# EAGLE design badge (EAGLE 7.5.0)
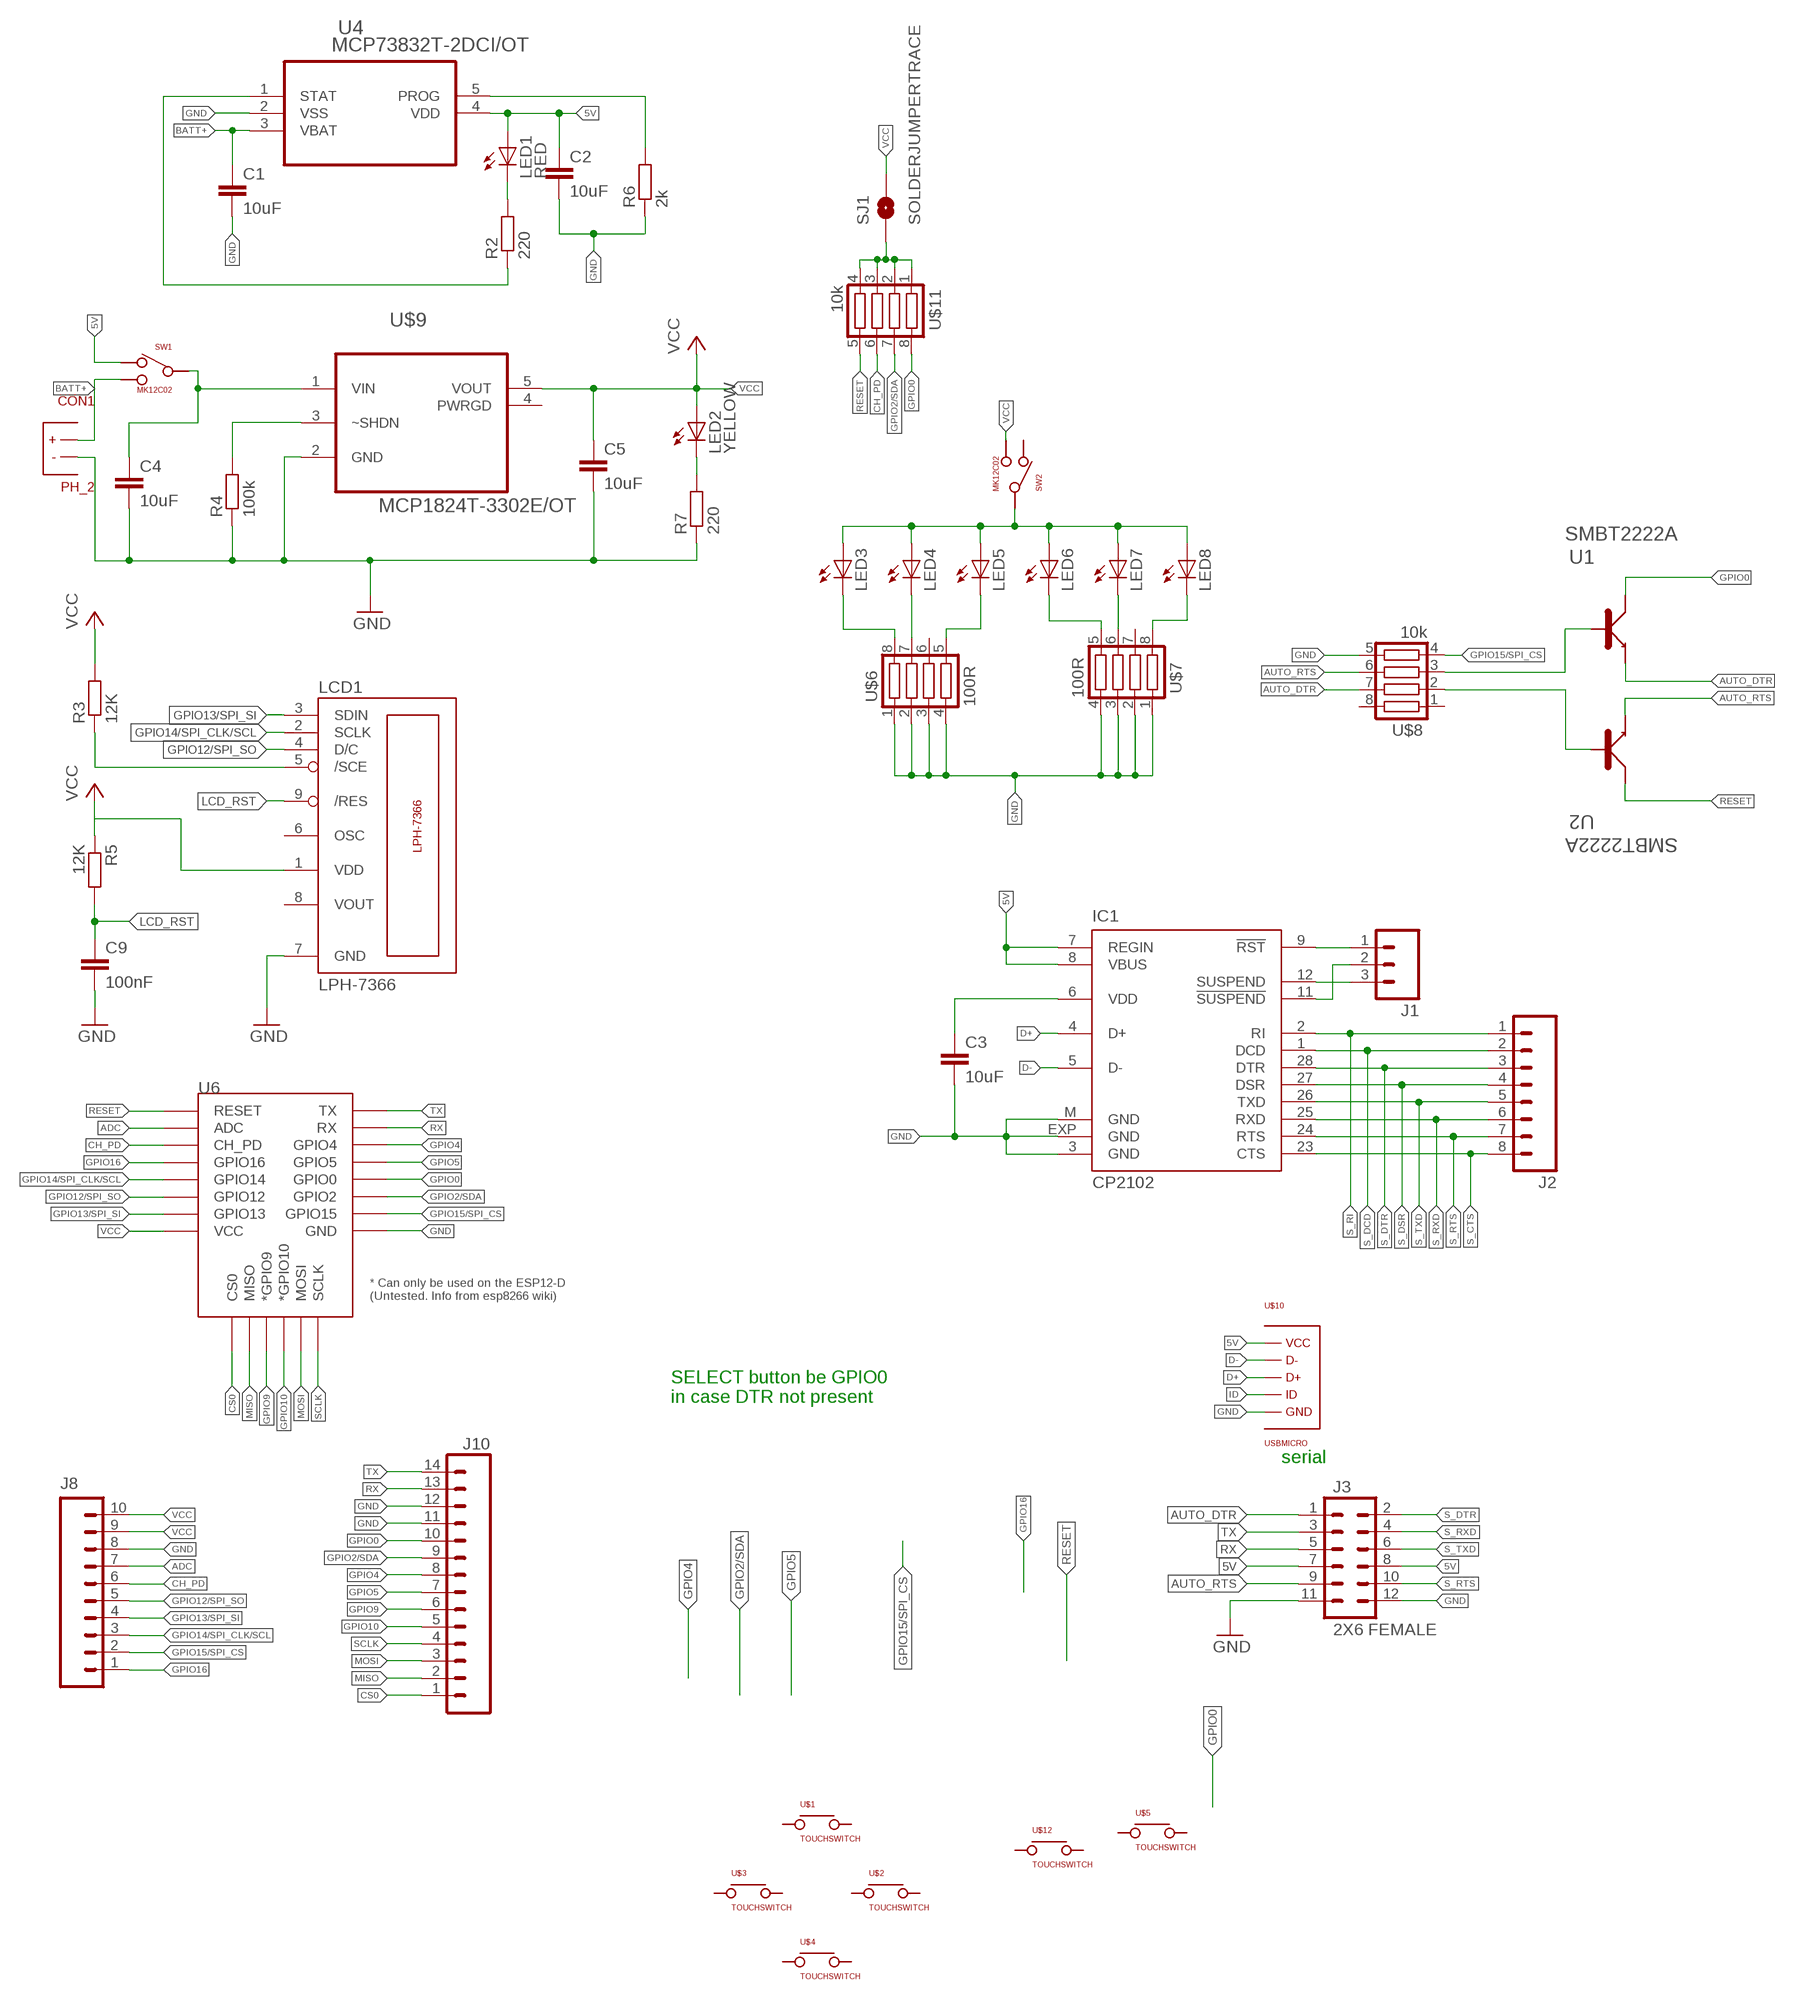
[diagram p0: schematic, sheet 1]

## Parts
C1  10uF  C-EUC0603K  [C0603K]
C2  10uF  C-EUC0603K  [C0603K]
C3  10uF  C-EUC0603K  [C0603K]
C4  10uF  C-EUC0603K  [C0603K]
C5  10uF  C-EUC0603K  [C0603K]
C9  100nF  C-EUC0603K  [C0603K]
CON1  PH_2  [PH_2]
IC1  CP2102  [MLP28]
J1  M03PTH  [1X03]
J2  M08SILK_FEMALE_PTH  [1X08]
J3  2X6 FEMALE  M06X2PTH_FEMALE  [2X6]
J8  M10SILK_FEMALE_PTH  [1X10]
J10  M14  [1X14]
LCD1  LPH-7366  [LPH-7366]
LED1  RED  LEDSML0805  [SML0805]
LED2  YELLOW  LEDSML0805  [SML0805]
LED3  LEDSML0805  [SML0805]
LED4  LEDSML0805  [SML0805]
LED5  LEDSML0805  [SML0805]
LED6  LEDSML0805  [SML0805]
LED7  LEDSML0805  [SML0805]
LED8  LEDSML0805  [SML0805]
R2  220  R-EU_R0603W  [R0603W]
R3  12K  R-EU_R0603W  [R0603W]
R4  100k  R-EU_R0603W  [R0603W]
R5  12K  R-EU_R0603W  [R0603W]
R6  2k  R-EU_R0603W  [R0603W]
R7  220  R-EU_R0603W  [R0603W]
SJ1  SOLDERJUMPERTRACE  [SJ_2S-TRACE]
SW1  MK12C02  [MK12C02]
SW2  MK12C02  [MK12C02]
U1  SMBT2222A  [SOT95P290X110-3N]
U2  SMBT2222A  [SOT95P290X110-3N]
U4  MCP73832T-2DCI/OT  [SOT95P300X145-5N]
U6  ESP12ESMD  [ESP12E-SMD]
U$1  TOUCHSWITCH  [EVQQWN03W]
U$2  TOUCHSWITCH  [EVQQWN03W]
U$3  TOUCHSWITCH  [EVQQWN03W]
U$4  TOUCHSWITCH  [EVQQWN03W]
U$5  TOUCHSWITCH  [EVQQWN03W]
U$6  100R  RES_ARR  [YC164]
U$7  100R  RES_ARR  [YC164]
U$8  10k  RES_ARR  [YC164]
U$9  MCP1824T-3302E/OT  [SOT95P270X145-5N]
U$10  USBMICRO  [USBMICRO]
U$11  10k  RES_ARR  [YC164]
U$12  TOUCHSWITCH  [EVQQWN03W]

## Nets
5V: C2.1 IC1.7(REGIN) IC1.8(VBUS) J3.7 J3.8 LED1.A SW1.P$2 U4.4(VDD) U$10.P$VCC
ADC: J8.7 U6.ADC
AUTO_DTR: J3.1 U1.2(E) U$8.7
AUTO_RTS: J3.9 U2.2(E) U$8.6
BATT+: C1.1 CON1.P$2 SW1.P$3 U4.3(VBAT)
CH_PD: J8.6 U6.CH_PD U$11.6
CS0: J10.1 U6.CS0
D+: IC1.4(D+) U$10.P$D+
D-: IC1.5(D-) U$10.P$D-
GND: C1.2 C2.2 C3.2 C4.2 C5.2 C9.2 CON1.P$1 IC1.3(GND) IC1.EXP(GND) IC1.M(GND) J3.11 J3.12 J8.8 J10.11 J10.12 LCD1.7(GND) R4.1 R6.1 R7.1 U4.2(VSS) U6.GND U$6.1 U$6.2 U$6.3 U$6.4 U$7.1 U$7.2 U$7.3 U$7.4 U$8.5 U$9.2(GND) U$10.P$GND
GPIO0: J10.10 U1.3(C) U6.GPIO0 U$11.8
GPIO2/SDA: J10.9 U6.GPIO2 U$11.7
GPIO4: J10.8 U6.GPIO4
GPIO5: J10.7 U6.GPIO5
GPIO9: J10.6 U6.GPIO9(*GPIO9)
GPIO10: J10.5 U6.GPIO10(*GPIO10)
GPIO12/SPI_SO: J8.5 LCD1.4(D/C) U6.GPIO12
GPIO13/SPI_SI: J8.4 LCD1.3(SDIN) U6.GPIO13
GPIO14/SPI_CLK/SCL: J8.3 LCD1.2(SCLK) U6.GPIO14
GPIO15/SPI_CS: J8.2 U6.GPIO15 U$8.4
GPIO16: J8.1 U6.GPIO16
ID: U$10.P$ID
LCD_RST: C9.1 LCD1.9(/RES) R5.2
MISO: J10.2 U6.MISO
MOSI: J10.3 U6.MOSI
N$1: C4.1 SW1.P$1 U$9.1(VIN)
N$2: LED3.A LED4.A LED5.A LED6.A LED7.A LED8.A SW2.P$1
N$3: LCD1.5(/SCE) R3.1
N$4: R4.2 U$9.3(~SHDN)
N$5: SJ1.1 U$11.1 U$11.2 U$11.3 U$11.4
N$6: R6.2 U4.5(PROG)
N$7: LED2.C R7.2
N$8: LED7.C U$7.6
N$9: LED1.C R2.2
N$10: R2.1 U4.1(STAT)
N$11: LED3.C U$6.8
N$12: LED4.C U$6.7
N$13: LED5.C U$6.5
N$15: U1.1(B) U$8.3
N$16: IC1.11(!SUSPEND) J1.2
N$17: IC1.12(SUSPEND) J1.3
N$18: U2.1(B) U$8.2
N$19: IC1.9(!RST) J1.1
N$20: C3.1 IC1.6(VDD)
N$22: LED6.C U$7.5
N$24: LED8.C U$7.8
RESET: U2.3(C) U6.RESET U$11.5
RX: J3.5 J10.13 U6.RXD0(RX)
S_CTS: IC1.23(CTS) J2.8
S_DCD: IC1.1(DCD) J2.2
S_DSR: IC1.27(DSR) J2.4
S_DTR: IC1.28(DTR) J2.3 J3.2
S_RI: IC1.2(RI) J2.1
S_RTS: IC1.24(RTS) J2.7 J3.10
S_RXD: IC1.25(RXD) J2.6 J3.4
S_TXD: IC1.26(TXD) J2.5 J3.6
SCLK: J10.4 U6.SCLK
TX: J3.3 J10.14 U6.TXD0(TX)
VCC: C5.1 J8.9 J8.10 LCD1.1(VDD) LED2.A R3.2 R5.1 SJ1.2 SW2.P$3 U6.VCC U$9.5(VOUT)
Unconnected: LCD1.6(OSC) LCD1.8(VOUT) SW2.P$2 U$1.P$1 U$1.P$2 U$1.P$3 U$1.P$4 U$2.P$1 U$2.P$2 U$2.P$3 U$2.P$4 U$3.P$1 U$3.P$2 U$3.P$3 U$3.P$4 U$4.P$1 U$4.P$2 U$4.P$3 U$4.P$4 U$5.P$1 U$5.P$2 U$5.P$3 U$5.P$4 U$6.6 U$7.7 U$8.1 U$8.8 U$9.4(PWRGD) U$12.P$1 U$12.P$2 U$12.P$3 U$12.P$4

## Notes on the sheet
- SELECT button be GPIO0
  in case DTR not present
- serial

## Library data of the parts
C1-C5 C9 = resistor:C-EU: CAPACITOR, European symbol
CON1 = badge:PH_2
IC1 = silabs:CP210*: Single-Chip USB to UART Bridge Source: www.silabs.com .. CP2101.pdf / cp2102.pdf; MF: FARNELL; MPN: CP2102-GM; OC_FARNELL: 9282130; OC_NEWARK: 30K5635
J1 = SparkFun-Connectors:M03: Header 3 Standard 3-pin 0.1" header. Use with straight break away headers (SKU : PRT-00116), right angle break away headers (PRT-00553), swiss pins (PRT-00743), machine pins (PRT-00117), and female headers (PRT-00115). Molex polarized connector foot print use with SKU : PRT-08232 with associated crimp pins and housings.
J2 = SparkFun-Connectors:M08: Header 8 Standard 8-pin 0.1" header. Use with straight break away headers (SKU : PRT-00116), right angle break away headers (PRT-00553), swiss pins (PRT-00743), machine pins (PRT-00117), and female headers (PRT-00115).; PROD_ID: CONN-08438
J3 = SparkFun-Connectors:M06X2; PROD_ID: CONN-12423
J8 = SparkFun-Connectors:M10: Header 10 Standard 10-pin 0.1" header. Use with straight break away headers (SKU : PRT-00116), right angle break away headers (PRT-00553), swiss pins (PRT-00743), machine pins (PRT-00117), and female headers (PRT-00115).; PROD_ID: CONN-11563
J10 = SparkFun-Connectors:M14: Header 14 Standard 14-pin 0.1" header. Use with straight break away headers (SKU : PRT-00116), right angle break away headers (PRT-00553), swiss pins (PRT-00743), machine pins (PRT-00117), and female headers (PRT-00115).
LCD1 = gm2:LPH-7366
LED1-LED8 = led:LED: LED OSRAM: - CHIPLED LG R971, LG N971, LY N971, LG Q971, LY Q971, LO R971, LY R971 LH N974, LH R974 LS Q976, LO Q976, LY Q976 LO Q996 - Hyper CHIPLED LW Q18S LB Q993, LB Q99A, LB R99A - SideLED LS A670, LO A670, LY A670, LG A670, LP A670 LB A673, LV A673, LT A673, LW A673 LH A674 LY A675 LS A676, LA A676, LO A676, LY A676, LW A676 LS A679, LY A679, LG A679 - Hyper Micro SIDELED® LS Y876, LA Y876, LO Y876, LY Y876 LT Y87S - SmartLED LW L88C, LW L88S LB L89C, LB L89S, LG L890 LS L89K, LO L89K, LY L89K LS L896, LA L896, LO L896, LY L896 - TOPLED LS T670, LO T670, LY T670, LG T670, LP T670 LSG T670, LSP T670, LSY T670, LOP T670, LYG T670 LG T671, LOG T671, LSG T671 LB T673, LV T673, LT T673, LW T673 LH T674 LS T676, LA T676, LO T676, LY T676, LB T676, LH T676, LSB T676, LW T676 LB T67C, LV T67C, LT T67C, LS T67K, LO T67K, LY T67K, LW E67C LS E67B, LA E67B, LO E67B, LY E67B, LB E67C, LV E67C, LT E67C LW T67C LS T679, LY T679, LG T679 LS T770, LO T770, LY T770, LG T770, LP T770 LB T773, LV T773, LT T773, LW T773 LH T774 LS E675, LA E675, LY E675, LS T675 LS T776, LA T776, LO T776, LY T776, LB T776 LHGB T686 LT T68C, LB T68C - Hyper Mini TOPLED® LB M676 - Mini TOPLED Santana® LG M470 LS M47K, LO M47K, LY M47K Source: http://www.osram.convergy.de LUXEON: - LUMILED® LXK2-PW12-R00, LXK2-PW12-S00, LXK2-PW14-U00, LXK2-PW14-V00 LXK2-PM12-R00, LXK2-PM12-S00, LXK2-PM14-U00 LXK2-PE12-Q00, LXK2-PE12-R00, LXK2-PE12-S00, LXK2-PE14-T00, LXK2-PE14-U00 LXK2-PB12-K00, LXK2-PB12-L00, LXK2-PB12-M00, LXK2-PB14-N00, LXK2-PB14-P00, LXK2-PB14-Q00 LXK2-PR12-L00, LXK2-PR12-M00, LXK2-PR14-Q00, LXK2-PR14-R00 LXK2-PD12-Q00, LXK2-PD12-R00, LXK2-PD12-S00 LXK2-PH12-R00, LXK2-PH12-S00 LXK2-PL12-P00, LXK2-PL12-Q00, LXK2-PL12-R00 Source: www.luxeon.com KINGBRIGHT: KA-3528ASYC Source: www.kingbright.com
R2-R7 = resistor:R-EU_: RESISTOR, European symbol
SJ1 = SparkFun-Retired:SOLDERJUMPER: Solder Jumper Standard SMD solder jumper. Used to automate production. Two varients : Normally Open and Normally Closed are the same, but have different paste layers. NC will have a large amount of paste and should jumper during reflow.
SW1 SW2 = badge:MK12C02
U1 U2 = badge:SMBT2222A: NPN Silicon Switching Transistors; MPN: SMBT2222A; OC_FARNELL: 1056537; OC_NEWARK: 97K9947; PACKAGE: SOT-23-3; SUPPLIER: INFINEON
U4 = Microchip_By_element14_Batch_1:MCP73832T-2DCI/OT: IC, BATT CHARGER, Li-Ion Li-Polymer, 500 mA; MPN: MCP73832T-2DCI/OT; OC_FARNELL: 1834892; OC_NEWARK: 84R5198; PACKAGE: SOT23-5; SUPPLIER: Microchip
U6 = esp8266modules:ESP12E: ESP12E Module
U$1-U$5 U$12 = badge:TOUCHSWITCH
U$6-U$8 U$11 = Simplex-rlc:RES_ARR: resistor chip array yageo YC164 series (8pin/4R)
U$9 = Microchip_By_element14_Batch_1:MCP1824T-3302E/OT: 300 mA, Low Voltage, Low Quiescent Current LDO Regulator; MPN: MCP1824T-3302E/OT; OC_FARNELL: 1578387; OC_NEWARK: 40M0704; PACKAGE: SOT23-5; SUPPLIER: Microchip
U$10 = badge:USBMICRO

## Board
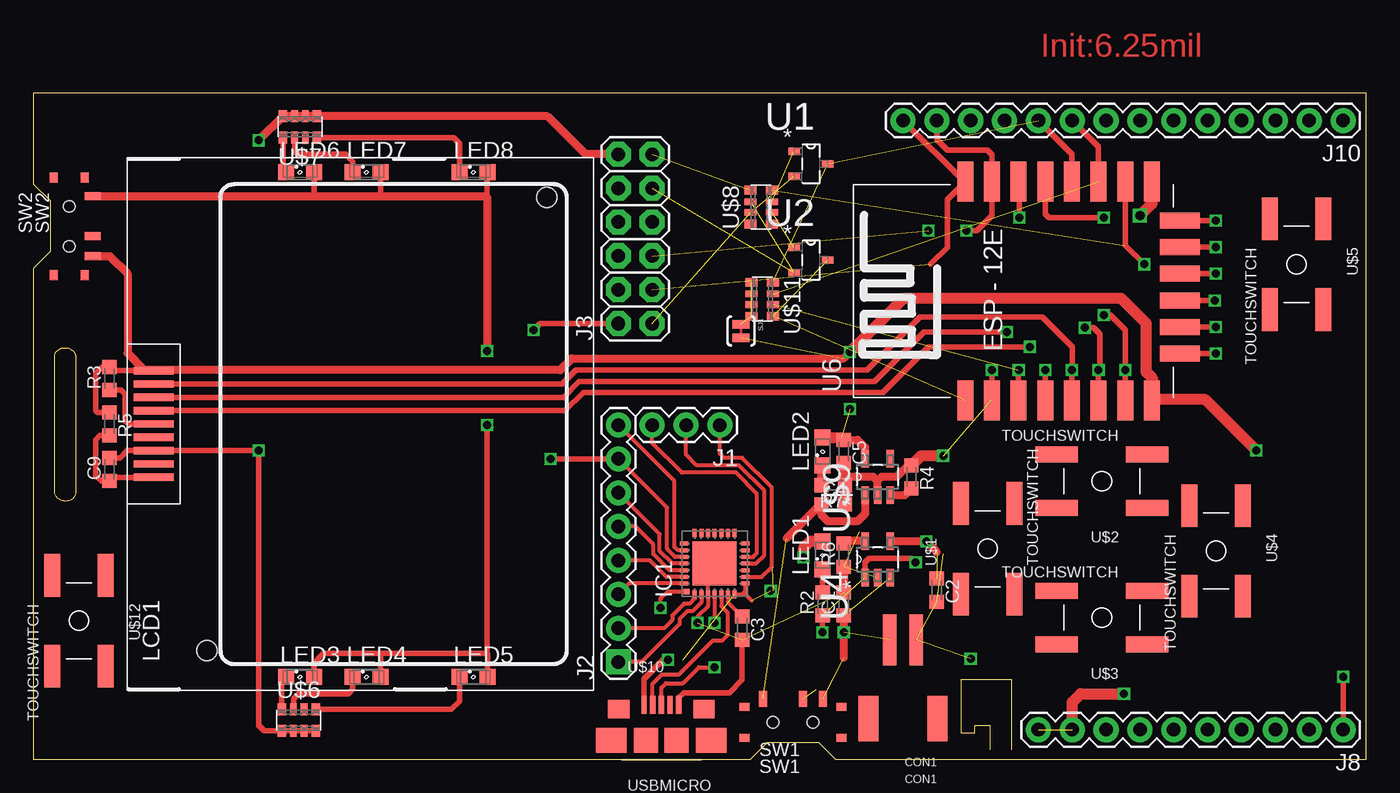
[diagram p1: board, top side]
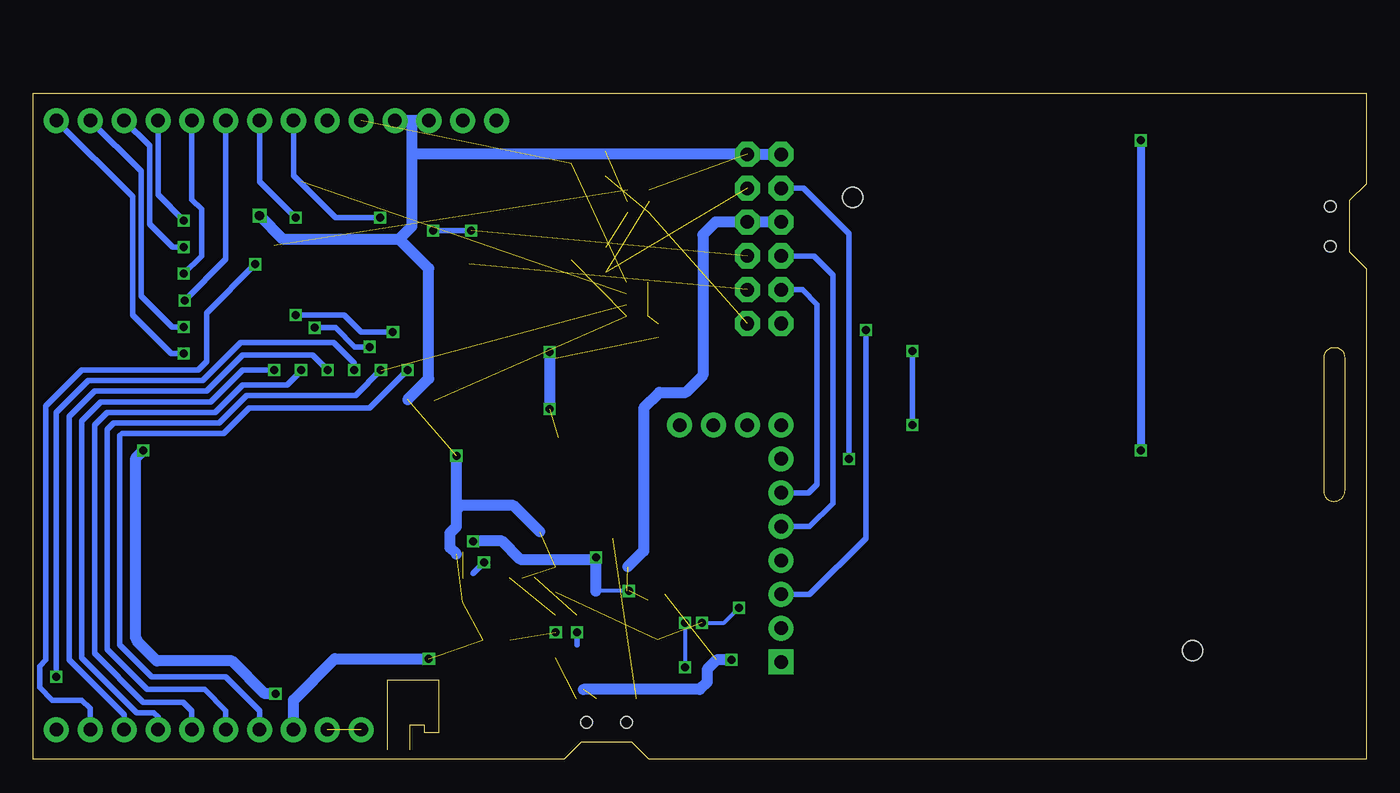
[diagram p2: board, bottom side, seen from below]

Size 100 x 50 mm. Coordinates in mm from the lower left corner, seen from the top.
Outline: 73.42,0.71 73.42,5.95 69.61,5.95 69.61,1.98 70.64,1.98 70.64,2.54 71.75,2.54 71.75,0.71
Outline: 0,0 53.82,0 55.09,1.27 58.9,1.27 60.17,0 100,0 100,50 0,50 0,43.18 1.27,41.91 1.27,38.1 0,36.83 0,0
Outline: 1.59,30.16 arc-90 2.3,30.88 2.46,30.88 arc-90 3.17,30.16 3.17,20.08 arc-90 2.46,19.37 2.38,19.37 arc-90 1.59,20.16 1.59,30.16
Copper layers (1*16): Top 0.035mm / dielectric 1.5mm / Bottom 0.035mm
Design rules "dirt_cheap_dirty_boards.v1": minimum track width 5mil, minimum drill 12mil, track to track 5mil, track to pad 5mil, pad to pad 5mil, via to via 5mil, smd to smd 0mil, copper to edge 10mil, drill to drill 10mil, minimum pad ring 10mil, minimum via ring 6mil, stop-mask expansion 2mil, vias tented up to drill 25mil, thermal gap 10mil

### Footprints (pad centres in the part's own frame; a part is rotated, then mirrored left to right if it is on the bottom)
C0603K = smd 1.05 x 1.08: 1 -0.875,0; 2 0.875,0
PH_2 = smd 1 x 3.8: P$1 -1,0; P$2 1,0 | smd 1.5 x 3.4: P$3 -2.6,5.9; P$4 2.6,5.9
MLP28 = smd 0.6 x 0.3: 1 -2.3,1.5; 2 -2.3,1; 3 -2.3,0.5; 4 -2.3,0; 5 -2.3,-0.5; 6 -2.3,-1; 7 -2.3,-1.5; 15 2.3,-1.5; 16 2.3,-1; 17 2.3,-0.5; 18 2.3,0; 19 2.3,0.5; 20 2.3,1; 21 2.3,1.5 | smd 0.3 x 0.6: 8 -1.5,-2.3; 9 -1,-2.3; 10 -0.5,-2.3; 11 0,-2.3; 12 0.5,-2.3; 13 1,-2.3; 14 1.5,-2.3; 22 1.5,2.3; 23 1,2.3; 24 0.5,2.3; 25 0,2.3; 26 -0.5,2.3; 27 -1,2.3; 28 -1.5,2.3 | smd 3.3 x 3.3: EXP 0,0 | smd 0.435 x 0.435: M -2.103,2.103
1X03 = drill 1.016 pad 1.88: 1 0,0; 2 2.54,0; 3 5.08,0
1X08 = drill 1.016 pad 1.88 square: 1 0,0 | drill 1.016 pad 1.88: 2 2.54,0; 3 5.08,0; 4 7.62,0; 5 10.16,0; 6 12.7,0; 7 15.24,0; 8 17.78,0
2X6 = drill 1.016 pad 1.88 octagon: 1 0,0; 2 0,2.54; 3 2.54,0; 4 2.54,2.54; 5 5.08,0; 6 5.08,2.54; 7 7.62,0; 8 7.62,2.54; 9 10.16,0; 10 10.16,2.54; 11 12.7,0; 12 12.7,2.54
1X10 = drill 1.016 pad 1.88: 1 0,0; 2 2.54,0; 3 5.08,0; 4 7.62,0; 5 10.16,0; 6 12.7,0; 7 15.24,0; 8 17.78,0; 9 20.32,0; 10 22.86,0
1X14 = drill 1.016 pad 1.88: 1 0,0; 2 2.54,0; 3 5.08,0; 4 7.62,0; 5 10.16,0; 6 12.7,0; 7 15.24,0; 8 17.78,0; 9 20.32,0; 10 22.86,0; 11 25.4,0; 12 27.94,0; 13 30.48,0; 14 33.02,0
LPH-7366 = smd 0.55 x 3: 1 4,17; 2 3,17; 3 2,17; 4 1,17; 5 0,17; 6 -1,17; 7 -2,17; 8 -3,17; 9 -4,17 | hole 1.5: -17,13; 17,-12.5
SML0805 = smd 1.2 x 1.2: A 1.05,0; C -1.05,0
R0603W = smd 1.05 x 1.08: 1 -0.875,0; 2 0.875,0
SJ_2S-TRACE = smd 0.635 x 1.27: 1 -0.508,0; 2 0.508,0
MK12C02 = smd 0.6 x 1.2: P$1 -2.25,1.75; P$2 0.75,1.75; P$3 2.25,1.75 | smd 0.75 x 0.6: P$4 -3.65,1.15; P$5 -3.65,-1.15; P$6 3.65,1.15; P$7 3.65,-1.15 | hole 0.85: -1.5,0; 1.5,0
SOT95P290X110-3N = smd 0.864 x 0.559: 1 -1.27,0.94; 2 -1.27,-0.94; 3 1.27,0
SOT95P300X145-5N = smd 1.321 x 0.559: 1 -1.372,0.94; 2 -1.372,0; 3 -1.372,-0.94; 4 1.372,-0.94; 5 1.372,0.94
ESP12E-SMD = smd 3 x 1.2: ADC -8.3,3.8; CH_PD -8.3,1.8; GND 8.1,-8.2; GPIO0 8.1,-2.2; GPIO2 8.1,-4.2; GPIO4 8.1,1.8; GPIO5 8.1,-0.2; GPIO12 -8.3,-4.2; GPIO13 -8.3,-6.2; GPIO14 -8.3,-2.2; GPIO15 8.1,-6.2; GPIO16 -8.3,-0.2; RESET -8.3,5.8; RXD0 8.1,3.8; TXD0 8.1,5.8; VCC -8.3,-8.2 | smd 1.2 x 3: CS0 -4.8,-10.3; GPIO9 -0.8,-10.3; GPIO10 1.2,-10.3; MISO -2.8,-10.3; MOSI 3.2,-10.3; SCLK 5.2,-10.3
EVQQWN03W = smd 1.2 x 3.2: P$1 -2,3.4; P$2 2,3.4; P$3 2,-3.4; P$4 -2,-3.4
YC164 = smd 0.65 x 0.9: 1 -1.275,-0.8; 4 1.275,-0.8; 5 1.275,0.8; 8 -1.275,0.8 | smd 0.5 x 0.9: 2 -0.4,-0.8; 3 0.4,-0.8; 6 0.4,0.8; 7 -0.4,0.8
SOT95P270X145-5N = smd 1.321 x 0.559: 1 -1.372,0.94; 2 -1.372,0; 3 -1.372,-0.94; 4 1.372,-0.94; 5 1.372,0.94
USBMICRO = smd 1.6 x 1.4: P$6 -3.2,2.35; P$7 3.2,2.35 | smd 1.8 x 1.9: P$8 -1.15,0; P$9 1.15,0 | smd 2.3 x 1.9: P$10 -3.75,0; P$11 3.75,0 | smd 0.4 x 1.35: P$D+ 0,2.675; P$D- -0.65,2.675; P$GND 1.3,2.675; P$ID 0.65,2.675; P$VCC -1.3,2.675

### Placement (x,y rotation side)
C1  60.8,11.67 90 top
C2  67.79,12.7 270 top
C3  53.18,9.84 270 top
C4  60.01,19.13 0 top
C5  60.8,23.1 270 top
C9  5.71,21.75 90 top
CON1  65.25,8.97 180 top
IC1  51.12,14.68 90 top
J1  51.51,25.08 180 top
J2  43.89,7.3 90 top
J3  46.43,32.7 90 top
J8  98.27,2.22 180 top
J10  98.27,47.94 180 top
LCD1  26.04,25.16 90 top
LED1  59.21,15.32 90 top
LED2  59.21,23.1 90 top
LED3  20,6.19 0 top
LED4  25,6.19 0 top
LED5  33.02,6.19 0 top
LED6  20,44.05 0 top
LED7  25,44.05 0 top
LED8  33.02,44.05 0 top
R2  59.21,11.67 90 top
R3  5.71,28.57 90 top
R4  65.88,21.19 270 top
R5  5.71,25.16 270 top
R6  60.8,15.32 90 top
R7  60.01,20.56 180 top
SJ1  53.1,32.15 270 top
SW1  56.99,2.78 0 top
SW2  2.7,40.01 270 top
U1  58.34,44.69 0 top
U2  58.34,37.47 0 top
U4  63.34,15 90 top
U6  75.72,35.24 90 top
U$1  71.6,15.8 0 top
U$2  80.17,20.88 90 top
U$3  80.17,10.63 90 top
U$4  88.73,15.64 180 top
U$5  94.78,37.15 180 top
U$6  19.92,2.94 0 top
U$7  20,47.47 180 top
U$8  54.61,41.43 90 top
U$9  63.34,21.19 90 top
U$10  47.12,1.43 0 top
U$11  54.69,34.53 270 top
U$12  3.41,10.4 180 top

### Tracks (layer width: path | path; a pad name or v marks a point on that pad's centre or on a via)
5V  (via drill 0.6)  (5 unrouted)
  Top 0.305: IC1.7 53.18,12.38 53.3,12.5 | 53.3,12.5 53.42,12.62 IC1.8 | 55.48,12.62 v55.32,12.62 | 53.89,11.91 53.3,12.5
  Top 0.406: U$10.P$VCC 45.82,6.06 47.23,7.46 v47.62,7.46
  Top 0.61: 67.79,15.56 v66.99,16.35 66.97,16.37 U4.4 | 59.2,16.35 LED1.A
  Top 0.813: 59.2,16.35 58.26,16.35 57.78,15.88 v57.78,15.16
  Bottom 0.305: v55.32,12.62 57.78,12.62
  Bottom 0.813: v66.99,16.35 66.97,16.37 64.85,16.37 63.48,15 57.94,15 v57.78,15.16 57.78,12.62 | v47.62,7.46 48.74,7.46 49.45,6.75 49.45,5.79 50.01,5.24 58.74,5.24 | J3.8 J3.7 48.82,40.32 49.77,39.37 49.77,28.81 51.04,27.54 53.02,27.54 54.21,26.35 54.21,15.64 55.4,14.45
ADC  (via drill 0.6)
  Top 0.406: v71.91,29.21 71.91,26.95 U6.ADC
  Bottom 0.406: v71.91,29.21 74.77,26.35 83.82,26.35 85.72,24.45 93.34,24.45 93.5,24.29 93.5,8.57 91.12,6.19 85.57,6.19 83.03,3.65 J8.7
AUTO_DTR  (2 unrouted)
AUTO_RTS  (2 unrouted)
BATT+  (via drill 0.6)  (3 unrouted)
  Top 0.61: C1.1 v60.8,9.53 60.8,7.62
CH_PD  (via drill 0.6)  (1 unrouted)
  Top 0.406: U6.CH_PD 73.92,29.16 v73.92,29.21
  Bottom 0.406: v73.92,29.21 75.83,27.3 83.98,27.3 86.04,25.24 93.98,25.24 94.46,24.77 94.46,8.26 91.44,5.24 87.15,5.24 85.57,3.65 J8.6
CS0  (via drill 0.6)
  Top 0.406: U6.CS0 v88.72,30.44 v88.72,30.45
  Bottom 0.406: v88.72,30.45 89.66,30.45 92.55,33.34 92.55,42.23 J10.1
D+  (via drill 0.6)
  Top 0.305: U$10.P$D+ 47.12,5.37 47.47,5.71 48.74,5.71 49.93,6.91 v51.12,6.91 | IC1.4 v51.12,10.24
  Bottom 0.305: v51.12,10.24 v51.12,6.91
D-
  Top 0.305: U$10.P$D- 46.47,5.67 47.15,6.35 48.42,6.35 50.96,8.89 51.67,8.89 52.07,9.29 52.07,11.03 51.62,11.49 IC1.5
GND  (via drill 0.6, 0.7)  (9 unrouted)
  Top 0.305: IC1.EXP 50.62,14.18 IC1.3 50.62,11.49 49.85,10.72 v49.85,10.24 | v47.07,11.35 47.07,12.06 47.59,12.58 IC1.M
  Top 0.406: C9.2 6.51,22.62 7.05,23.16 LCD1.7 16.89,23.16 v16.91,23.18 16.91,2.54 17.31,2.14 U$6.1 U$6.2 U$6.3 U$6.4 | U$10.P$GND 48.42,4.61 48.82,5 52.23,5 53.18,5.95 C3.2
  Top 0.61: R6.1 C1.2 | U$9.2 63.34,20.88 | 63.34,20.88 63.02,21.19 60.96,21.19 60.8,21.35 | R4.1 65.64,22.07 64.77,21.19 63.66,21.19 63.34,20.88 | J3.12 41.43,45.4 38.58,48.26 U$7.1 U$7.2 U$7.3 U$7.4 v16.91,46.45
  Top 0.813: U6.GND 83.92,41.7 v83.03,40.8 | C4.2 R7.1 60.8,20.64 60.8,21.35 C5.2 | v68.26,22.78 66.59,22.78 R4.1
  Bottom 0.305: v49.85,10.24 48.18,10.24 v47.07,11.35
  Bottom 0.61: v16.91,46.45 v16.91,23.18
  Bottom 0.813: J10.12 71.75,47.94 | 71.75,47.94 J10.11 | 72.55,39.05 81.28,39.05 v83.03,40.8 | 72.55,39.05 71.6,40.01 71.6,45.4 | 71.6,45.4 71.6,47.78 71.75,47.94 | J8.8 80.49,4.45 77.39,7.54 v70.33,7.54 | 68.26,15.4 68.74,15.88 68.74,16.99 68.26,17.46 68.26,18.73 | 68.26,18.73 v68.26,22.78 | 71.91,26.99 70.33,28.57 70.33,36.83 72.55,39.05 | 61.99,17.07 63.98,19.05 67.94,19.05 68.26,18.73 | J3.12 J3.11 71.6,45.4
GPIO0  (2 unrouted)
  Top 0.406: U6.GPIO0 77.92,45.42 J10.10
GPIO2/SDA  (1 unrouted)
  Top 0.406: U6.GPIO2 79.92,45.97 J10.9
GPIO4  (via drill 0.6)
  Top 0.406: U6.GPIO4 73.98,43.29 v73.98,40.64
  Bottom 0.406: v73.98,40.64 77.31,40.64 80.49,43.81 J10.8
GPIO5  (via drill 0.6)
  Top 0.406: U6.GPIO5 75.92,40.92 76.2,40.64 v80.33,40.64
  Bottom 0.406: v80.33,40.64 83.03,43.34 J10.7
GPIO9  (via drill 0.6)
  Top 0.406: U6.GPIO9 v88.65,34.44 88.72,34.44
  Bottom 0.406: J10.6 85.57,37.53 v88.65,34.44
GPIO10  (via drill 0.6)
  Top 0.406: U6.GPIO10 v88.72,36.44
  Bottom 0.406: J10.5 88.11,42 87.38,41.27 87.38,37.78 v88.72,36.44
GPIO12/SPI_SO  (via drill 0.6)
  Top 0.406: U6.GPIO12 v79.92,29.21 80.01,29.3 80.01,31.91 79.53,32.38 v78.9,32.38 | v74.77,30.96 67.15,30.96 63.74,27.54 41.27,27.54 39.89,26.16 LCD1.4
  Bottom 0.406: v79.92,29.21 79.92,29.14 80.96,28.1 84.3,28.1 86.36,26.04 94.46,26.04 95.41,25.08 95.41,7.94 91.76,4.29 88.74,4.29 88.11,3.65 J8.5 | v74.77,30.96 75.88,30.96 77.31,32.38 v78.9,32.38
GPIO13/SPI_SI  (via drill 0.6)
  Top 0.406: U6.GPIO13 v81.92,29.2 v81.92,29.21 81.92,32.23 80.8,33.34 v80.33,33.34 | v73.03,32.07 66.83,32.07 63.1,28.34 40.96,28.34 39.78,27.16 LCD1.3
  Bottom 0.406: v81.92,29.21 84.3,29.21 86.68,26.83 94.93,26.83 96.36,25.4 96.36,7.62 92.23,3.49 90.96,3.49 90.65,3.17 J8.4 | v73.03,32.07 75.41,32.07 76.68,33.34 v80.33,33.34
GPIO14/SPI_CLK/SCL  (via drill 0.6)
  Top 0.406: U6.GPIO14 v77.92,29.21 77.95,29.23 77.95,30.96 75.72,33.18 66.52,33.18 62.55,29.21 40.72,29.21 39.67,28.16 LCD1.2
  Bottom 0.406: v77.92,29.21 79.04,30.32 84.3,30.32 87,27.62 95.41,27.62 97.31,25.72 97.31,7.46 93.19,3.33 J8.3 93.19,2.54
GPIO15/SPI_CS  (via drill 0.6)  (1 unrouted)
  Top 0.406: U6.GPIO15 81.92,38.57 v83.34,37.15
  Bottom 0.406: v83.34,37.15 87,33.5 87,29.84 87.63,29.21 96.36,29.21 99.06,26.51 99.06,7.46 99.54,6.99 99.54,5.4 98.58,4.45 96.36,4.45 95.73,3.81 J8.2
GPIO16  (via drill 0.6)
  Top 0.406: U6.GPIO16 v75.92,29.21 | J8.1 v98.27,6.19
  Bottom 0.406: v75.92,29.21 75.92,29.73 77.47,31.27 84.45,31.27 87.31,28.42 95.89,28.42 98.27,26.04 v98.27,6.19
LCD_RST
  Top 0.406: R5.2 5,24.29 4.68,23.97 4.68,21.27 5.08,20.88 C9.1 6,21.16 LCD1.9
MISO  (via drill 0.6)
  Top 0.406: U6.MISO v88.72,32.44
  Bottom 0.406: v88.72,32.44 89.59,32.44 91.92,34.77 91.92,44.13 J10.2
MOSI  (via drill 0.6)
  Top 0.406: U6.MOSI v88.72,38.44
  Bottom 0.406: v88.72,38.44 89.56,38.44 91.28,40.16 91.28,46.04 J10.3
N$1  (1 unrouted)
  Top 0.61: U$9.1 62.4,18.43 61.83,17.86 59.61,17.86 59.13,18.34 C4.1 59.05,19.13 56.52,16.59
N$2  (via drill 0.6)
  Top 0.406: LED3.A 21.05,7.24 21.75,7.94 26.11,7.94 | 26.11,7.94 34.05,7.94 | 34.05,7.94 v34.05,25.08 | LED8.A 34.05,44.03 34.05,41.91 | LED5.A 34.07,7.92 34.05,7.94 | LED4.A 26.05,7.88 26.11,7.94 | LED7.A 26.05,42.27 26.04,42.26 | LED6.A 21.05,42.35 20.95,42.26
  Top 0.61: SW2.P$1 20.95,42.26 26.04,42.26 33.95,42.26 34.05,42.15 34.05,41.91 v34.05,30.64
  Bottom 0.406: v34.05,25.08 v34.05,30.64
N$3
  Top 0.406: LCD1.5 7.15,25.16 6.91,25.4 6.91,27.38 6.59,27.7 R3.1
N$4
  Top 0.61: U$9.3 65.39,19.82 R4.2
N$5  (4 unrouted)
N$6
  Top 0.61: U4.5 60.98,16.37 R6.2
N$7
  Top 0.61: R7.2 59.13,21.97 LED2.C
N$8
  Top 0.406: LED7.C 23.97,44.07 23.97,44.85 23.42,45.4 19.84,45.4 19.6,45.64 U$7.6
N$9
  Top 0.406: LED1.C R2.2
N$10  (via drill 0.6)  (1 unrouted)
  Top 0.406: R2.1 v59.21,9.53 | v66.2,14.76 65.88,15.08 62.71,15.08 62.39,14.76 62.39,13.64 U4.1
  Bottom 0.406: v59.21,9.53 59.21,8.57 | 66.99,13.97 v66.2,14.76
N$11
  Top 0.406: U$6.8 18.65,5.89 LED3.C
N$12
  Top 0.406: U$6.7 19.52,4.52 19.92,4.92 23.65,4.92 23.97,5.24 23.97,6.17 LED4.C
N$13
  Top 0.406: U$6.5 31.36,3.74 31.99,4.37 31.99,6.17 LED5.C
N$15  (1 unrouted)
N$16
  Top 0.305: IC1.11 54.21,14.68 54.85,15.32 54.85,20.16 52.94,22.07 49.77,22.07 48.97,22.86 J1.2
N$17
  Top 0.305: IC1.12 54,15.18 54.29,15.48 54.29,19.92 52.7,21.51 48.66,21.51 46.43,23.73 J1.3
N$18  (1 unrouted)
N$19
  Top 0.305: IC1.9 54.64,13.68 55.4,14.45 55.4,20.4 53.18,22.62 51.83,22.62 51.51,22.94 J1.1
N$20
  Top 0.305: IC1.6 52.12,11.78 52.47,11.43 C3.1
N$22
  Top 0.406: U$7.5 18.73,44.28 LED6.C
N$24
  Top 0.406: U$7.8 31.52,46.67 31.99,46.2 31.99,44.07 LED8.C
RESET  (2 unrouted)
RX  (via drill 0.6)  (1 unrouted)
  Top 0.406: J10.13 67.79,46.51 68.58,45.72 71.6,45.72 71.92,45.39 U6.RXD0 71.91,40.8 70.8,39.69 v70.01,39.69
  Bottom 0.406: v70.01,39.69 v67.15,39.69
S_CTS
  Top 0.305: IC1.23 48.37,15.68 48.1,15.95 48.1,20.88 J2.8
S_DCD
  Top 0.305: IC1.1 49.62,12.07 49.21,11.67 48.82,11.67 47.94,10.79 47.94,10.48 47.31,9.84 J2.2
S_DSR
  Top 0.305: IC1.27 47.51,13.68 46.28,14.92 J2.4
S_DTR  (via drill 0.6)
  Top 0.305: IC1.28 44.7,13.18 J2.3
  Top 0.406: J3.2 38.02,32.7 v37.54,32.23
  Bottom 0.406: v37.54,32.23 37.54,16.59 41.75,12.38 J2.3
S_RI
  Top 0.305: IC1.2 50.12,11.78 49.45,11.11 49.05,11.11 48.5,10.56 48.5,10.16 45.64,7.3 J2.1
S_RTS  (via drill 0.6)
  Top 0.305: IC1.24 48.16,15.18 47.55,15.8 47.55,18.89 J2.7
  Top 0.406: v38.81,22.54 J2.7
  Bottom 0.406: J3.10 42.23,42.86 38.81,39.45 v38.81,22.54
S_RXD
  Top 0.305: IC1.25 47.94,14.68 46.99,15.64 46.99,16.91 J2.6
  Bottom 0.406: J3.4 42.31,35.24 41.2,34.13 41.2,20.64 41.83,20 J2.6
S_TXD
  Top 0.305: IC1.26 47.73,14.18 46.51,15.4 46.51,16.11 45.16,17.46 J2.5
  Bottom 0.406: J3.6 41.43,37.78 40.01,36.35 40.01,19.21 41.75,17.46 J2.5
SCLK  (via drill 0.6)
  Top 0.406: U6.SCLK v88.72,40.44
  Bottom 0.406: J10.4 90.65,42.37 v88.72,40.44
TX  (1 unrouted)
  Top 0.406: J10.14 69.85,43.34 U6.TXD0 68.58,42 68.58,38.42 67.31,37.15
VCC  (via drill 0.6)  (3 unrouted)
  Top 0.406: R5.1 4.84,26.04 4.68,26.19 4.68,28.97 5.16,29.45 R3.2 6.01,29.16 LCD1.1 9.04,29.2 9.05,29.21
  Top 0.61: U$9.5 62.4,23.4 61.83,23.97 C5.1 | 83.98,26.89 U6.VCC | v61.28,30.56 60.8,30.08 40.4,30.08 39.53,29.21 9.05,29.21 8.33,29.21 7.06,30.48 7.06,36.43 5.74,37.76 SW2.P$3
  Top 0.813: 59.15,24.21 LED2.A 60.63,24.15 C5.1 | 83.98,26.89 83.98,28.57 83.5,29.05 83.5,32.7 81.6,34.61 65.33,34.61 v61.28,30.56 | J8.9 77.95,4.29 78.58,4.92 v81.84,4.92 | v91.76,23.18 87.95,26.99 83.97,26.99 U6.VCC
  Bottom 0.813: v61.28,30.56 v61.28,26.27 | v81.84,4.92 82.63,4.92 85.09,7.38 90.73,7.38 92.23,8.89 92.23,8.97 92.31,9.05 92.31,22.62 v91.76,23.18

### Text on the board
Top: Init:6.25mil